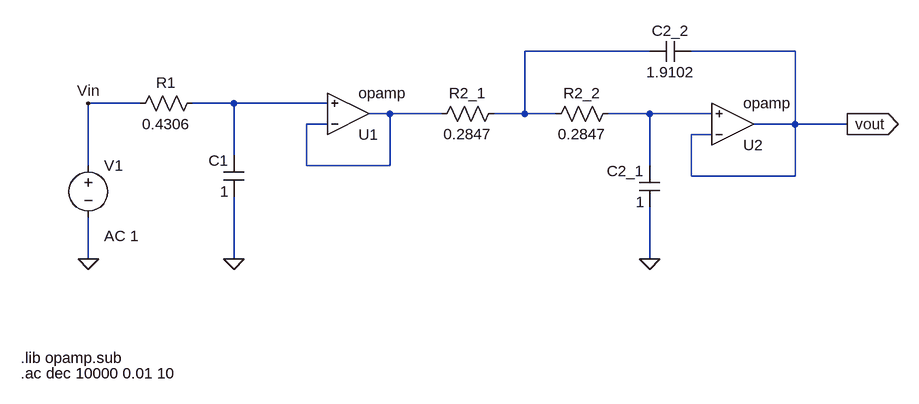
[diagram p0: schematic Bessel-Normalizado.asc]
Bessel-Normalizado.asc, the LTspice schematic file:
Version 4.1
SHEET 1 1200 680
WIRE 752 -144 560 -144
WIRE 976 -144 816 -144
WIRE -32 -64 -112 -64
WIRE 112 -64 48 -64
WIRE 256 -64 112 -64
WIRE 352 -48 320 -48
WIRE 432 -48 352 -48
WIRE 560 -48 560 -144
WIRE 560 -48 512 -48
WIRE 608 -48 560 -48
WIRE 752 -48 688 -48
WIRE 848 -48 752 -48
WIRE 256 -32 224 -32
WIRE 976 -32 976 -144
WIRE 976 -32 912 -32
WIRE 1056 -32 976 -32
WIRE 848 -16 816 -16
WIRE 112 16 112 -64
WIRE -112 32 -112 -64
WIRE 224 32 224 -32
WIRE 352 32 352 -48
WIRE 352 32 224 32
WIRE 752 32 752 -48
WIRE 816 48 816 -16
WIRE 976 48 976 -32
WIRE 976 48 816 48
WIRE -112 176 -112 112
WIRE 112 176 112 80
WIRE 752 176 752 96
FLAG -112 176 0
FLAG 112 176 0
FLAG 1056 -32 vout
IOPIN 1056 -32 Out
FLAG 752 176 0
FLAG -112 -64 Vin
SYMBOL voltage -112 16 R0
WINDOW 123 24 124 Left 2
WINDOW 39 0 0 Left 0
SYMATTR Value2 AC 1
SYMATTR InstName V1
SYMATTR Value ""
SYMBOL cap 128 80 R180
WINDOW 0 24 56 Left 2
WINDOW 3 24 8 Left 2
SYMATTR InstName C1
SYMATTR Value 1
SYMBOL res 64 -80 R90
WINDOW 0 0 56 VBottom 2
WINDOW 3 32 56 VTop 2
SYMATTR InstName R1
SYMATTR Value 0.4306
SYMBOL OpAmps\\opamp 288 16 M180
SYMATTR InstName U1
SYMBOL res 528 -64 R90
WINDOW 0 0 56 VBottom 2
WINDOW 3 32 56 VTop 2
SYMATTR InstName R2_1
SYMATTR Value 0.2847
SYMBOL res 704 -64 R90
WINDOW 0 0 56 VBottom 2
WINDOW 3 32 56 VTop 2
SYMATTR InstName R2_2
SYMATTR Value 0.2847
SYMBOL cap 816 -160 R90
WINDOW 0 0 32 VBottom 2
WINDOW 3 32 32 VTop 2
SYMATTR InstName C2_2
SYMATTR Value 1.9102
SYMBOL cap 768 96 R180
WINDOW 0 24 56 Left 2
WINDOW 3 24 8 Left 2
SYMATTR InstName C2_1
SYMATTR Value 1
SYMBOL OpAmps\\opamp 880 32 M180
SYMATTR InstName U2
TEXT -216 328 Left 2 !.lib opamp.sub
TEXT -216 352 Left 2 !.ac dec 10000 0.01 10

The netlist it stands for:
* Bessel-Normalizado.asc
V1 Vin 0 AC 1
C1 0 N002 1
R1 N002 Vin 0.4306
X§U1 N003 N002 N003 opamp Aol=100K GBW=10Meg  ; pins invin noninvin out
R2_1 N001 N003 0.2847
R2_2 N004 N001 0.2847
C2_2 vout N001 1.9102
C2_1 0 N004 1
X§U2 vout N004 vout opamp Aol=100K GBW=10Meg  ; pins invin noninvin out
.lib opamp.sub
.ac dec 10000 0.01 10
.backanno
.end